# EasyEDA Pro project ProPrj_STM L_2026-07-04.epro, schematic Schematic1
Board Name: Board1; Create Date: 2025-10-13; Page Name: P1; Project Name: STM Evolution Board; Schematic Name: Schematic1; Update Date: 2025-10-17; Company: EasyEDA.com; Page Size: A4; Version: V1.0
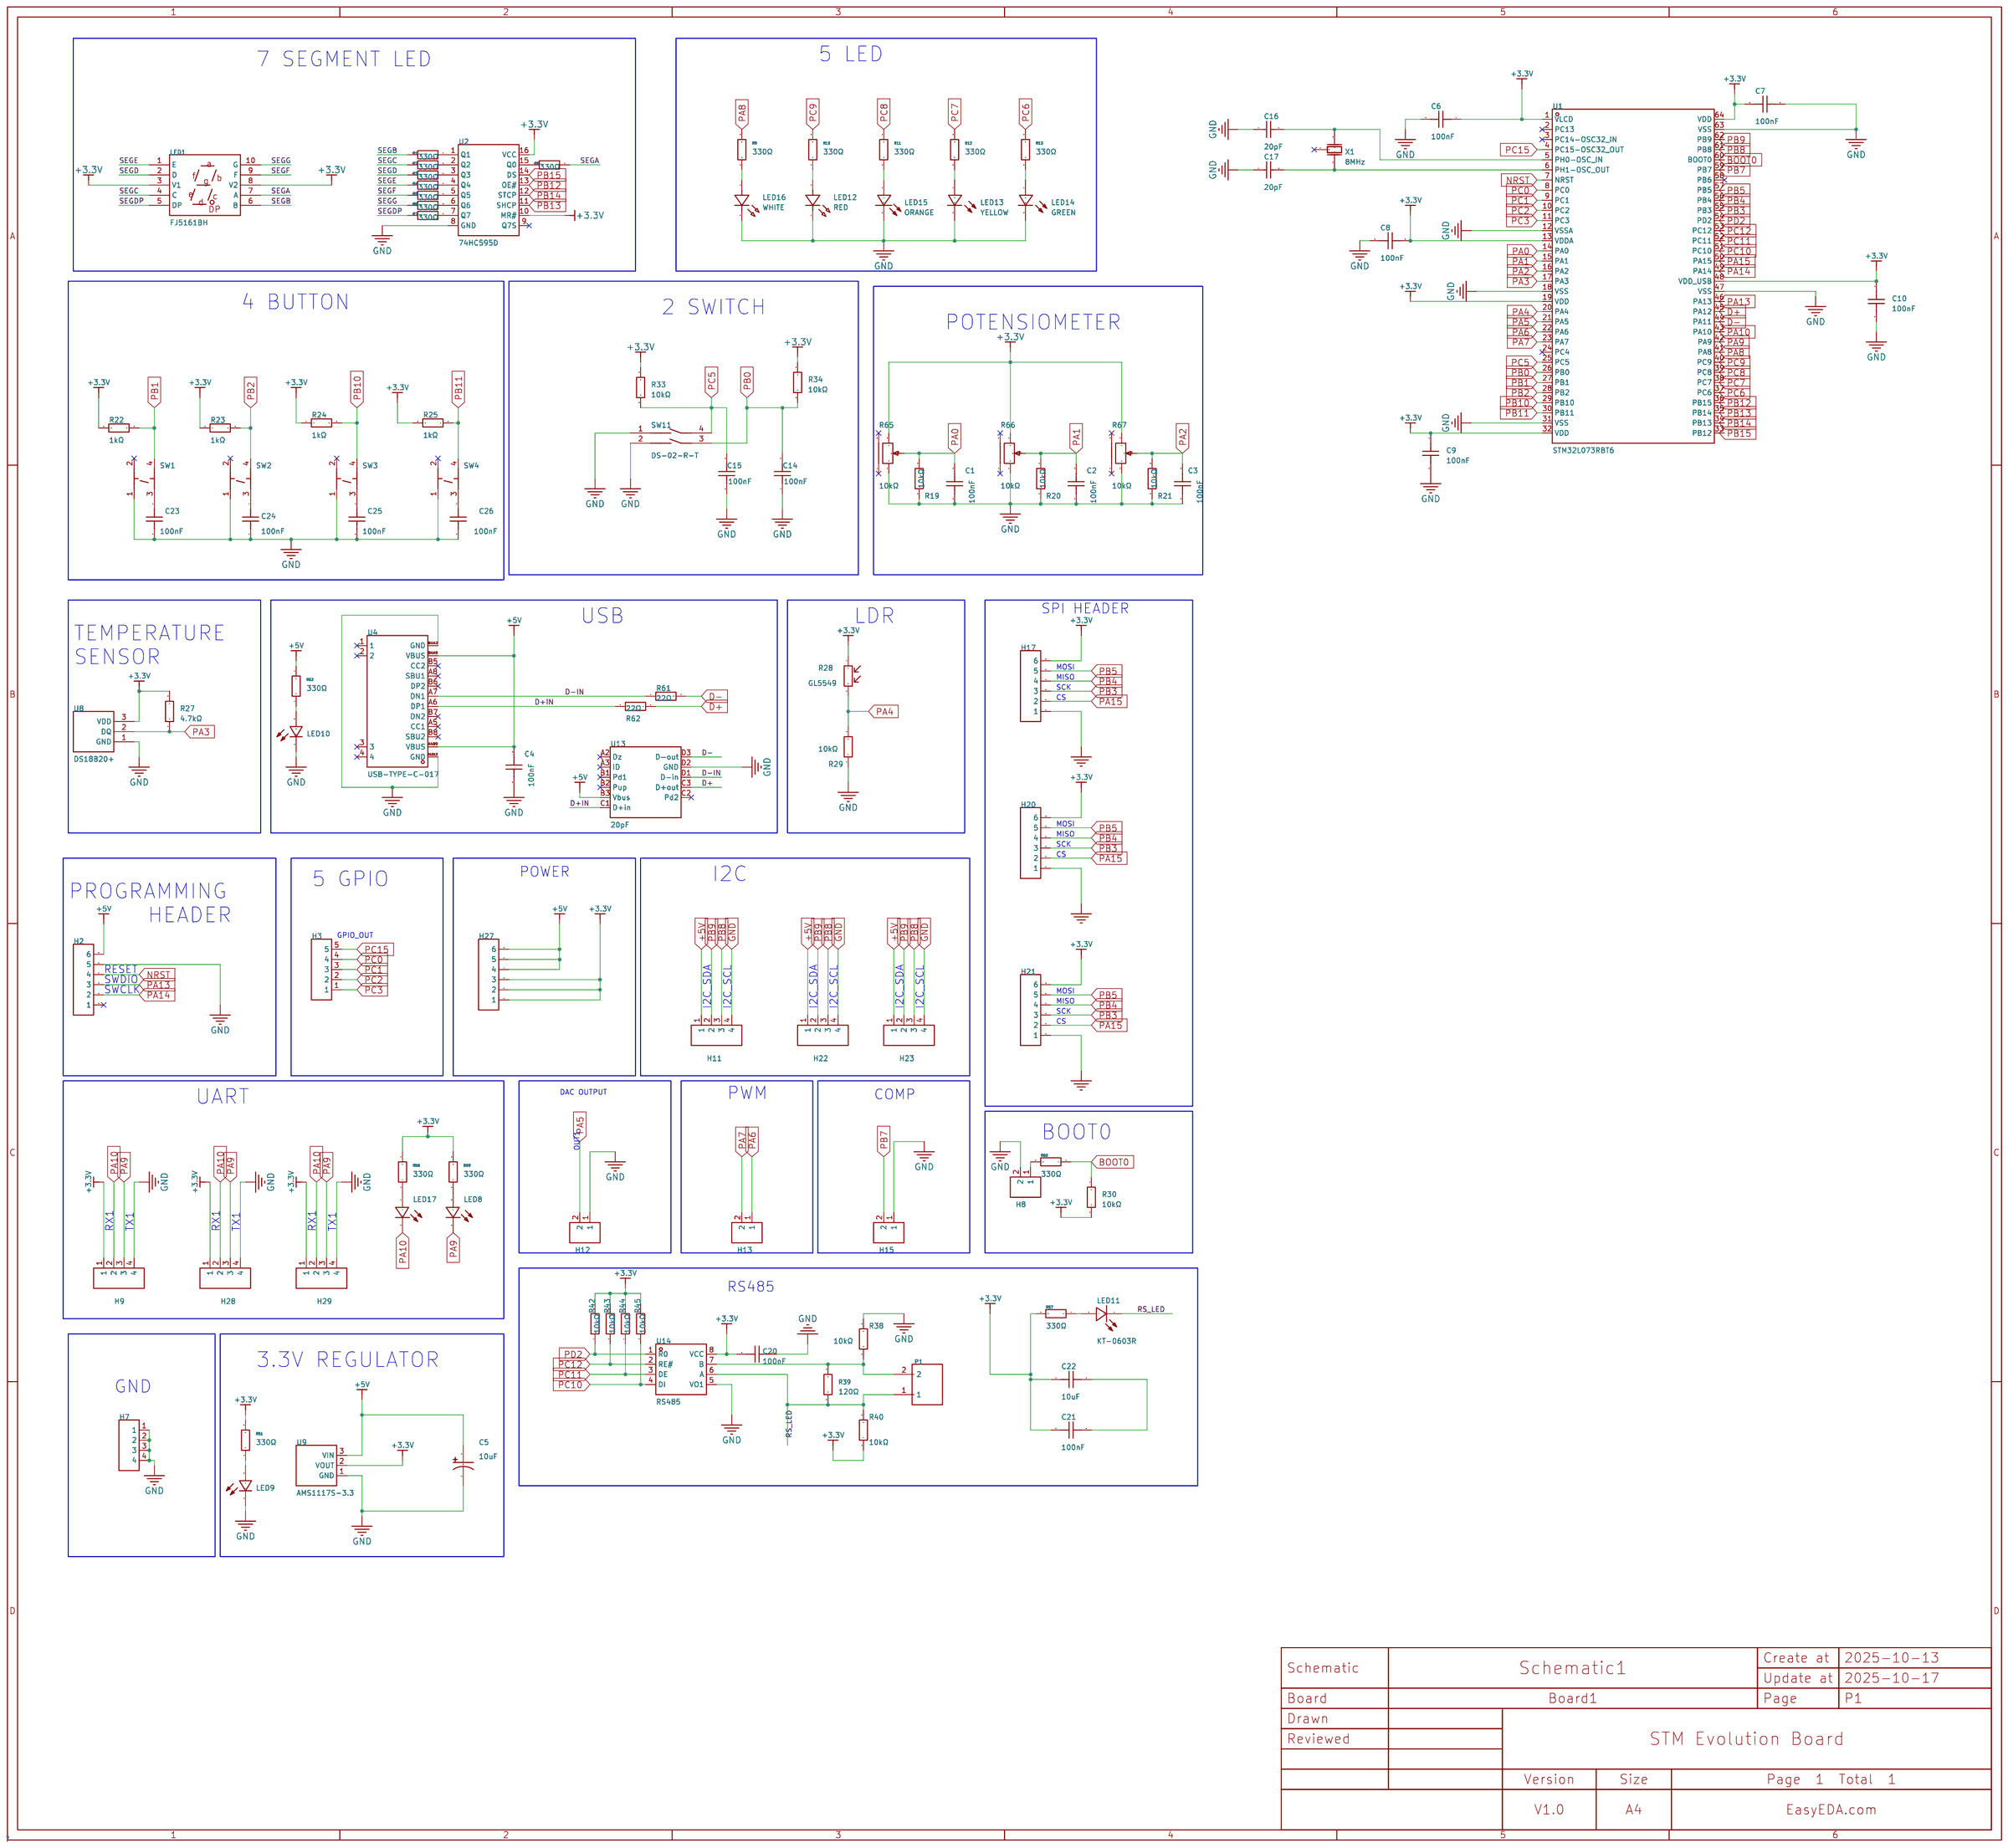
[diagram p0: schematic sheet]

## Parts
C1  100nF  [C0603]
C2  100nF  [C0603]
C3  100nF  [C0603]
C4  100nF  [C0603]
C5  10uF  [CAP-SMD_L3.2-W1.6]
C6  100nF  [C0603]
C7  100nF  [C0603]
C8  100nF  [C0603]
C9  100nF  [C0603]
C10  100nF  [C0603]
C14  100nF  [C0603]
C15  100nF  [C0603]
C16  20pF  [C0603]
C17  20pF  [C0603]
C20  100nF  [C0603]
C21  100nF  [C0603]
C22  10uF  [C0603]
C23  100nF  [C0603]
C24  100nF  [C0603]
C25  100nF  [C0603]
C26  100nF  [C0603]
H2  2.54-1x6P直针  [HDR-TH_6P-P2.54-V-M-1]
H3  PH2.54-1X5P-H25  [HDR-TH_5P-P2.54-V-M-3]
H7  PZ2.54-1X4P-H25  [HDR-TH_4P-P2.54-V-M]
H8  1.27-1*2P针  [HDR-TH_2P-P1.27-V-M]
H9  PZ2.54-1X4P-H25  [HDR-TH_4P-P2.54-V-M]
H11  PZ2.54-1X4P-H25  [HDR-TH_4P-P2.54-V-M]
H12  1.27-1*2P针  [HDR-TH_2P-P1.27-V-M]
H13  1.27-1*2P针  [HDR-TH_2P-P1.27-V-M]
H15  1.27-1*2P针  [HDR-TH_2P-P1.27-V-M]
H17  2.54-1x6P直针  [HDR-TH_6P-P2.54-V-M-1]
H20  2.54-1x6P直针  [HDR-TH_6P-P2.54-V-M-1]
H21  2.54-1x6P直针  [HDR-TH_6P-P2.54-V-M-1]
H22  PZ2.54-1X4P-H25  [HDR-TH_4P-P2.54-V-M]
H23  PZ2.54-1X4P-H25  [HDR-TH_4P-P2.54-V-M]
H27  2.54-1x6P直针  [HDR-TH_6P-P2.54-V-M-1]
H28  PZ2.54-1X4P-H25  [HDR-TH_4P-P2.54-V-M]
H29  PZ2.54-1X4P-H25  [HDR-TH_4P-P2.54-V-M]
LED1  FJ5161BH  [LED-SEG-TH_FJ5161BH]
LED8  YLED0603R  [LED0603-FD]
LED9  NCD0603G1  [LED0603-RD_1]
LED10  NCD0603G1  [LED0603-RD_1]
LED11  KT-0603R  [LED0603-RD]
LED12  RED  [LED-TH_BD3.8-P2.54-RD]
LED13  YELLOW  [LED-TH_BD4.0-P2.54-FD]
LED14  GREEN  [LED-TH_BD4.0-P2.54-FD]
LED15  ORANGE  [LED-TH_BD3.0-P2.54-FD]
LED16  WHITE  [LED-TH_BD3.8-P2.54-FD_WHITE]
LED17  YLED0603R  [LED0603-FD]
P1  WJ126V-5.0-2P  [CONN-TH_WJ126V-5.0-2P]
R1  330Ω  [R0603]
R2  330Ω  [R0603]
R3  330Ω  [R0603]
R4  330Ω  [R0603]
R5  330Ω  [R0603]
R6  330Ω  [R0603]
R7  330Ω  [R0603]
R8  330Ω  [R0603]
R9  330Ω  [R0603]
R10  330Ω  [R0603]
R11  330Ω  [R0603]
R12  330Ω  [R0603]
R13  330Ω  [R0603]
R19  10kΩ  [R0603]
R20  10kΩ  [R0603]
R21  10kΩ  [R0603]
R22  1kΩ  [R0603]
R23  1kΩ  [R0603]
R24  1kΩ  [R0603]
R25  1kΩ  [R0603]
R27  4.7kΩ  [R0603]
R28  GL5549  [RES-TH_L5.1-W4.3-P3.40-D0.5]
R29  10kΩ  [R0603]
R30  10kΩ  [R0603]
R33  10kΩ  [R0603]
R34  10kΩ  [R0603]
R38  10kΩ  [R0603]
R39  120Ω  [R0603]
R40  10kΩ  [R0603]
R42  10kΩ  [R0603]
R43  10kΩ  [R0603]
R44  10kΩ  [R0603]
R45  10kΩ  [R0603]
R51  330Ω  [R0603]
R52  330Ω  [R0603]
R57  330Ω  [R0603]
R58  330Ω  [R0603]
R59  330Ω  [R0603]
R60  330Ω  [R0603]
R61  22Ω  [R0603]
R62  22Ω  [R0603]
R65  10kΩ  [RES-ADJ-TH_RK09K1130AJ3]
R66  10kΩ  [RES-ADJ-TH_RK09K1130AJ3]
R67  10kΩ  [RES-ADJ-TH_RK09K1130AJ3]
SW1  LXW-TS-6X6X5-SMD  [SW-SMD_4P-L6.0-W6.0-P4.50-LS7.2]
SW2  LXW-TS-6X6X5-SMD  [SW-SMD_4P-L6.0-W6.0-P4.50-LS7.2]
SW3  LXW-TS-6X6X5-SMD  [SW-SMD_4P-L6.0-W6.0-P4.50-LS7.2]
SW4  LXW-TS-6X6X5-SMD  [SW-SMD_4P-L6.0-W6.0-P4.50-LS7.2]
SW11  DS-02-R-T  [SW-TH_4P-P2.54_DS-02R]
U1  STM32L073RBT6  [LQFP-64_L10.0-W10.0-P0.50-LS12.0-BL]
U2  74HC595D  [SOIC-16_L9.9-W3.9-P1.27-LS6.0-BL]
U4  USB-TYPE-C-017  [USB-TYPE-C-SMD_C9900008089]
U8  DS18B20+  [TO-92-3_L4.9-W3.7-P1.27-L]
U9  AMS1117S-3.3  [SOT-89-3_L4.5-W2.5-P1.50-LS4.1-BR]
U13  20pF  [BGA-11_L2.0-W1.4-P0.50-TL]
U14  RS485  [SOP-8_L4.9-W3.9-P1.27-LS6.0-BL]
X1  8MHz  [OSC-SMD_3P-L3.2-W1.3-P1.20-L]

## Library data of the parts
C1-C4 C6-C10 C14 C15 C20 C21 C23-C26 = CC0603KRX7R9BB104: Capacitance:100nF Tolerance:±10% Tolerance:±10% Voltage Rating:50V Temperature Coefficient:X7R; LCSC Part Name: 100nF ±10% 50V; Supplier Part: C14663; Manufacturer: YAGEO(国巨); Supplier Footprint: 0603; JLCPCB Part Class: Basic Part; Datasheet: https://item.szlcsc.com/datasheet/CC0603KRX7R9BB104/15331.html; Supplier: LCSC; Tolerance: ±10%; Voltage Rating: 50V; Temperature Coefficient: X7R
C5 = NOJA106M010RWJ: Capacitance: Tolerance:±20% Tolerance:±20% Rated Voltage: Equivalent Series   Resistance(ESR):2.2Ω@100kHz Leakage Current(DCL): Dissipation Factor:6% Operating Temperature:-55℃~+105℃ Operating Temperature:-55℃~+105℃; LCSC Part Name: 10uF ±20% 10V; Supplier Part: C444733; Manufacturer: Kyocera AVX; Supplier Footprint: CASE-A-3216-18(mm); JLCPCB Part Class: Extended Part; Datasheet: https://atta.szlcsc.com/upload/public/pdf/source/20191107/C444734_54A3C6EA0F0DA246BA7C015D9FD916EF.pdf; Supplier: LCSC; Tolerance: ±20%; Equivalent Series   Resistance(ESR): 2.2Ω@100kHz; Dissipation Factor: 6%; Operating Temperature: -55℃~+105℃
C16 C17 = CL10C200JB8NNNC: Capacitance:20pF Tolerance:±5% Tolerance:±5% Voltage Rating:50V Temperature Coefficient:C0G; LCSC Part Name: 20pF ±5% 50V; Supplier Part: C1648; Manufacturer: SAMSUNG(三星); Supplier Footprint: 0603; JLCPCB Part Class: Basic Part; Datasheet: https://item.szlcsc.com/datasheet/CL10C200JB8NNNC/2000.html; Supplier: LCSC; Tolerance: ±5%; Voltage Rating: 50V; Temperature Coefficient: C0G
C22 = CL10A106KP8NNNC: Capacitance:10uF Tolerance:±10% Tolerance:±10% Voltage Rating:10V Temperature Coefficient:X5R; LCSC Part Name: 10uF ±10% 10V; Supplier Part: C19702; Manufacturer: SAMSUNG(三星); Supplier Footprint: 0603; JLCPCB Part Class: Basic Part; Datasheet: https://item.szlcsc.com/datasheet/CL10A106KP8NNNC/20411.html; Supplier: LCSC; Tolerance: ±10%; Voltage Rating: 10V; Temperature Coefficient: X5R
H2 H17 H20 H21 H27 = 2.54-1x6P直针: Pin Structure:1x6P Pitch:2.54mm Row Spacing:- Circluar Pins/Square Pins:Pin Header Mounting Type:Through Hole Number of Rows:1 Number of Pins:6P Current Rating:3A Voltage Rating (Max):- Length of Mating Pin:6mm Insulation Height:2.5mm Length of End Connec; LCSC Part Name: 1x6P 间距:2.54mm 方针 直插; Supplier Part: C37208; Manufacturer: BOOMELE(博穆精密); Supplier Footprint: 插件,P=2.54mm; JLCPCB Part Class: Extended Part; Datasheet: https://item.szlcsc.com/datasheet/2.54-1x6P%25E7%259B%25B4%25E9%2592%2588/38187.html; Supplier: LCSC; Pin Structure: 1x6P; Pitch: 2.54mm; Circluar Pins/Square Pins: Pin Header; Mounting Type: Through Hole; Number of Rows: 1; Number of Pins: 6P; Current Rating: 3A; Length of Mating Pin: 6mm; Insulation Height: 2.5mm; Length of End Connection Pin: 3mm; Contact Material: Brass; Contact Plating: Gold; Operating Temperature: -40℃~+105℃; Color: Black
H3 = PH2.54-1X5P-H25: Pin Structure:1x5P Pitch:2.54mm Row Spacing:- Circluar Pins/Square Pins:Pin Header Mounting Type:Through Hole Number of Rows:1 Number of Pins:5P Current Rating:3A Voltage Rating (Max):- Length of Mating Pin:6mm Insulation Height:2.5mm Length of End Connec; LCSC Part Name: 1x5P 间距:2.54mm 方针 直插; Supplier Part: C42431835; Manufacturer: JXTCONN(聚兴泰); Supplier Footprint: 插件,P=2.54mm; JLCPCB Part Class: Extended Part; Datasheet: https://item.szlcsc.com/datasheet/PH2.54-1X5P-H25/44458965.html; Supplier: LCSC; Pin Structure: 1x5P; Pitch: 2.54mm; Circluar Pins/Square Pins: Pin Header; Mounting Type: Through Hole; Number of Rows: 1; Number of Pins: 5P; Current Rating: 3A; Length of Mating Pin: 6mm; Insulation Height: 2.5mm; Length of End Connection Pin: 3mm; Contact Material: Brass; Contact Plating: Gold; Operating Temperature: -40℃~+105℃; Color: Black
H7 H9 H11 H22 H23 H28 H29 = PZ2.54-1X4P-H25: Pin Structure:1x4P Pitch:2.54mm Row Spacing:- Circluar Pins/Square Pins:Pin Header Mounting Type:Through Hole Number of Rows:1 Number of Pins:4P Current Rating:3A Voltage Rating (Max):- Length of Mating Pin:6mm Insulation Height:2.5mm Length of End Connec; LCSC Part Name: 1x4P 间距:2.54mm 方针 直插; Supplier Part: C42431787; Manufacturer: JXTCONN(聚兴泰); Supplier Footprint: 插件,P=2.54mm; JLCPCB Part Class: Extended Part; Datasheet: https://item.szlcsc.com/datasheet/PZ2.54-1X4P-H25/44458917.html; Supplier: LCSC; Pin Structure: 1x4P; Pitch: 2.54mm; Circluar Pins/Square Pins: Pin Header; Mounting Type: Through Hole; Number of Rows: 1; Number of Pins: 4P; Current Rating: 3A; Length of Mating Pin: 6mm; Insulation Height: 2.5mm; Length of End Connection Pin: 3mm; Contact Material: Brass; Contact Plating: Gold; Operating Temperature: -40℃~+105℃; Color: Black
H8 H12 H13 H15 = 1.27-1*2P针: Pin Structure:1x2P Pitch:1.27mm Row Spacing:- Circluar Pins/Square Pins:Pin Header Mounting Type:Through Hole Number of Rows:1 Number of Pins:2P Current Rating:3A Voltage Rating (Max):- Length of Mating Pin:3mm Insulation Height:1.7mm Length of End Connec; LCSC Part Name: 1x2P 间距:1.27mm 方针 直插; Supplier Part: C703015; Manufacturer: BOOMELE(博穆精密); Supplier Footprint: 插件,P=1.27mm; JLCPCB Part Class: Extended Part; Datasheet: https://item.szlcsc.com/datasheet/1.27-1*2P%25E9%2592%2588/738187.html; Supplier: LCSC; Pin Structure: 1x2P; Pitch: 1.27mm; Circluar Pins/Square Pins: Pin Header; Mounting Type: Through Hole; Number of Rows: 1; Number of Pins: 2P; Current Rating: 3A; Length of Mating Pin: 3mm; Insulation Height: 1.7mm; Length of End Connection Pin: 2.5mm; Contact Material: Brass; Operating Temperature: -55℃~+105℃; Color: Black
LED1 = FJ5161BH: Number of Characters:1 Display Type:7 Segment Digit/Alpha Size(inch):0.56 Pd - Power Dissipation:- Illumination Color:Red LED Polarity:Common Anode; LCSC Part Name: 1位0.56英寸红色数码管 共阳极; Supplier Part: C8092; Manufacturer: 志浩; Supplier Footprint: 插件; JLCPCB Part Class: Extended Part; Datasheet: https://item.szlcsc.com/datasheet/FJ5161BH/8574.html; Supplier: LCSC; Number of Characters: 1; Display Type: 7 Segment; Digit/Alpha Size(inch): 0.56; Illumination Color: Red; LED Polarity: Common Anode
LED8 LED17 = YLED0603R: Emitted Color:Red Forward Voltage (VF):1.8V~2.4V Forward Voltage (VF):1.8V~2.4V Power Dissipation:- Forward Current:25mA Dominant Wavelength:620nm~625nm Dominant Wavelength:620nm~625nm Peak Wavelength:- Diode Configuration:- Lens Color:- Color Temperature; Supplier Part: C19171390; Manufacturer: YONGYUTAI(永裕泰); Supplier Footprint: 0603; JLCPCB Part Class: Extended Part; Datasheet: https://atta.szlcsc.com/upload/public/pdf/source/20231027/FB19AF06E2C70028E58AB5CEDD1BDC72.pdf; Supplier: LCSC; Emitted Color: Red; Forward Voltage (VF): 1.8V~2.4V; Forward Current: 25mA; Dominant Wavelength: 620nm~625nm; Operating Temperature: -40℃~+85℃
LED9 LED10 = NCD0603G1: Illumination Color:Emerald Voltage - Forward(Vf):2.6V~3.6V Voltage - Forward(Vf):2.6V~3.6V Power(Watts):72mW Forward Current:20mA Wavelength - Dominant:515nm~530nm Wavelength - Dominant:515nm~530nm Lens Color:- Luminous Intensity:330mcd~900mcd Luminous In; Supplier Part: C84267; Manufacturer: 国星光电; Supplier Footprint: 0603; JLCPCB Part Class: Extended Part; Datasheet: https://item.szlcsc.com/datasheet/NCD0603G1/85436.html; Supplier: LCSC; Illumination Color: Emerald; Voltage - Forward(Vf): 2.6V~3.6V; Power(Watts): 72mW; Forward Current: 20mA; Wavelength - Dominant: 515nm~530nm; Luminous Intensity: 330mcd~900mcd; Viewing Angle: 130°; Operating Temperature: -30℃~+85℃
LED11 = KT-0603R: Emitted Color:Red Power Dissipation:- Forward Current:- Dominant Wavelength:- Dominant Wavelength:- Peak Wavelength:- Diode Configuration:- Lens Color:- Color Temperature:- Color Temperature:- Viewing Angle:- Mounting Sytle:- Operating Temperature:-40℃~+8; LCSC Part Name: 0603 红灯 高亮; Supplier Part: C2286; Manufacturer: KENTO; Supplier Footprint: 0603; JLCPCB Part Class: Basic Part; Datasheet: https://atta.szlcsc.com/upload/public/pdf/source/20160616/1466072038404.pdf; Supplier: LCSC; Emitted Color: Red; Operating Temperature: -40℃~+85℃
LED12 = XL-302SURD: Lamp Holder Type:3mm Round Lens Illumination Color:Red Voltage - Forward(Vf):2.2V Voltage - Forward(Vf):2.2V Power(Watts):50mW Forward Current:20mA Wavelength - Dominant:620nm~630nm Wavelength - Dominant:620nm~630nm Peak Wavelength:625nm Diode Configurati; Supplier Part: C2895470; Manufacturer: XINGLIGHT(成兴光); Supplier Footprint: 插件,D=3mm; JLCPCB Part Class: Extended Part; Datasheet: https://item.szlcsc.com/datasheet/XL-302SURD/3136185.html; Supplier: LCSC; Lamp Holder Type: 3mm Round Lens; Illumination Color: Red; Voltage - Forward(Vf): 2.2V; Power(Watts): 50mW; Forward Current: 20mA; Wavelength - Dominant: 620nm~630nm; Peak Wavelength: 625nm; Lens Color: Red Lens; Luminous Intensity: 1000mcd; Viewing Angle: 35°; Operating Temperature: -20℃~+85℃
LED13 LED14 = 204-10UYT/S530-A3: Lamp Holder Type:3mm圆形灯头 Emitted Color:Yellow Forward Voltage (VF):2V Forward Voltage (VF):2V Forward Current:20mA Dominant Wavelength:589nm Dominant Wavelength:589nm Peak Wavelength:591nm Lens Color:黄色透镜 Luminous Intensity:500mcd Luminous Intensity:500mc; LCSC Part Name: 黄灯; Supplier Part: C282137; Manufacturer: EVERLIGHT(亿光); Supplier Footprint: 插件,D=3mm; JLCPCB Part Class: Extended Part; Datasheet: https://atta.szlcsc.com/upload/public/pdf/source/20181026/C282137_6D218B8CC23FC5624A0E16147EFD8814.pdf; Supplier: LCSC; Lamp Holder Type: 3mm圆形灯头; Emitted Color: Yellow; Forward Voltage (VF): 2V; Forward Current: 20mA; Dominant Wavelength: 589nm; Peak Wavelength: 591nm; Lens Color: 黄色透镜; Luminous Intensity: 500mcd; Viewing Angle: 20°
LED15 = TJ-L3FYTXHAMCGLFLC0A-A5: Lamp Holder Type:3mm Round Lens Illumination Color:Orange Voltage - Forward(Vf):2.6V Voltage - Forward(Vf):2.6V Power(Watts):72mW Forward Current:20mA Wavelength - Dominant:600nm~610nm Wavelength - Dominant:600nm~610nm Peak Wavelength:610nm Lens Color:Dif; LCSC Part Name: 橙灯; Supplier Part: C330758; Manufacturer: TOGIALED(统佳); Supplier Footprint: 插件,D=3mm; JLCPCB Part Class: Extended Part; Datasheet: https://item.szlcsc.com/datasheet/TJ-L3FYTXHAMCGLFLC0A-A5/310371.html; Supplier: LCSC; Lamp Holder Type: 3mm Round Lens; Illumination Color: Orange; Voltage - Forward(Vf): 2.6V; Power(Watts): 72mW; Forward Current: 20mA; Wavelength - Dominant: 600nm~610nm; Peak Wavelength: 610nm; Lens Color: Diffused Orange Lens; Luminous Intensity: 500mcd; Viewing Angle: 45°; Operating Temperature: -20℃~+80℃
LED16 = XL-302UWC: Lamp Holder Type:3mm Round Lens Illumination Color:White Voltage - Forward(Vf):3.2V Voltage - Forward(Vf):3.2V Power(Watts):70mW Forward Current:20mA Lens Color:Water Clear Color Temperature:6000K~8000K Color Temperature:6000K~8000K Luminous Intensity:800; LCSC Part Name: 白发白短脚发光器件; Supplier Part: C2895458; Manufacturer: XINGLIGHT(成兴光); Supplier Footprint: 插件,D=3mm; JLCPCB Part Class: Extended Part; Datasheet: https://atta.szlcsc.com/upload/public/pdf/source/20250716/2CD7D6C127B884119A4550035EC69AE5.pdf; Supplier: LCSC; Lamp Holder Type: 3mm Round Lens; Illumination Color: White; Voltage - Forward(Vf): 3.2V; Power(Watts): 70mW; Forward Current: 20mA; Lens Color: Water Clear; Color Temperature: 6000K~8000K; Luminous Intensity: 8000mcd; Viewing Angle: 30°; Operating Temperature: -20℃~+85℃
P1 = WJ126V-5.0-2P: Structure:1x2P Pitch:5mm Color:Green Mounting Style:Straight Current Rating (Max):18A Voltage Rating (Max):250V Number of Pins:2P Number of Rows:1 Wire Gauge - AWG:14~26 Wire Gauge - AWG:14~26 Wire Gauge - mm2:2.5 Wire Gauge - mm2:2.5 Number of PINs Per R; LCSC Part Name: 5mm 1x2P 排数:1 每排P数:2 直插; Supplier Part: C8404; Manufacturer: KANGNEX(康奈克斯电气); Supplier Footprint: 插件,P=5mm; JLCPCB Part Class: Extended Part; Datasheet: https://atta.szlcsc.com/upload/public/pdf/source/20191225/C8404_8F52D87DF851D149A4DEA9BD9FA83F9A.pdf; Supplier: LCSC; Structure: 1x2P; Pitch: 5mm; Color: Green; Mounting Style: Straight; Current Rating (Max): 18A; Voltage Rating (Max): 250V; Number of Pins: 2P; Number of Rows: 1; Wire Gauge - AWG: 14~26; Wire Gauge - mm2: 2.5; Number of PINs Per Row: 2; Operating Temperature Range: -40℃~+105℃
R1-R13 R51 R52 R57-R60 = RC0603FR-07330RL: Type:Thick Film Resistors Resistance: Tolerance:±1% Tolerance:±1% Power(Watts): Overload Voltage (Max): Temperature Coefficient:±100ppm/℃ Temperature Coefficient:±100ppm/℃ Operating Temperature Range:-55℃~+155℃ Operating Temperature Range:-55℃~+155℃; LCSC Part Name: 厚膜电阻 330Ω ±1% 100mW; Supplier Part: C105881; Manufacturer: YAGEO(国巨); Supplier Footprint: 0603; JLCPCB Part Class: Extended Part; Datasheet: https://atta.szlcsc.com/upload/public/pdf/source/20180821/C275644_0D56F95EFF785E7D9A1FEF436B37DA78.pdf; Supplier: LCSC; Type: Thick Film Resistors; Tolerance: ±1%; Temperature Coefficient: ±100ppm/℃; Operating Temperature Range: -55℃~+155℃
R19-R21 R29 R30 R33 R34 R38 R40 R42-R45 = RC0603FR-0710KL: Type:Thick Film Resistors Resistance: Tolerance:±1% Tolerance:±1% Power(Watts): Overload Voltage (Max): Temperature Coefficient:±100ppm/℃ Temperature Coefficient:±100ppm/℃ Operating Temperature Range:-55℃~+155℃ Operating Temperature Range:-55℃~+155℃; LCSC Part Name: 厚膜电阻 10kΩ ±1% 100mW; Supplier Part: C98220; Manufacturer: YAGEO(国巨); Supplier Footprint: 0603; JLCPCB Part Class: Extended Part; Datasheet: https://atta.szlcsc.com/upload/public/pdf/source/20180927/C295883_E8D83085EA81BD7DE0B2B681138C15EE.pdf; Supplier: LCSC; Type: Thick Film Resistors; Tolerance: ±1%; Temperature Coefficient: ±100ppm/℃; Operating Temperature Range: -55℃~+155℃
R22-R25 = RC0603FR-071KL: Type:Thick Film Resistors Resistance:1kΩ Tolerance:±1% Tolerance:±1% Power(Watts):100mW Voltage-Supply(Max):75V Temperature Coefficient:±100ppm/℃ Temperature Coefficient:±100ppm/℃ Operating Temperature:-55℃~+155℃ Operating Temperature:-55℃~+155℃; LCSC Part Name: 厚膜电阻 1kΩ ±1% 100mW; Supplier Part: C22548; Manufacturer: YAGEO(国巨); Supplier Footprint: 0603; JLCPCB Part Class: Extended Part; Datasheet: https://atta.szlcsc.com/upload/public/pdf/source/20180316/70C0E2BDAE7FCC62C531A5A58D202EE1.pdf; Supplier: LCSC; Type: Thick Film Resistors; Tolerance: ±1%; Power(Watts): 100mW; Voltage-Supply(Max): 75V; Temperature Coefficient: ±100ppm/℃; Operating Temperature: -55℃~+155℃
R27 = RC0603FR-074K7L: Type:Thick Film Resistor Resistance:4.7kΩ Tolerance:±1% Tolerance:±1% Power(Watts):100mW Voltage-Supply(Max):75V Temperature Coefficient:±100ppm/℃ Temperature Coefficient:±100ppm/℃ Operating Temperature:-55℃~+155℃ Operating Temperature:-55℃~+155℃; LCSC Part Name: 厚膜电阻 4.7kΩ ±1% 100mW; Supplier Part: C99782; Manufacturer: YAGEO(国巨); Supplier Footprint: 0603; JLCPCB Part Class: Extended Part; Datasheet: https://atta.szlcsc.com/upload/public/pdf/source/20250610/89E4D743C004A82A45145C7A2CC3A578.pdf; Supplier: LCSC; Type: Thick Film Resistor; Tolerance: ±1%; Power(Watts): 100mW; Voltage-Supply(Max): 75V; Temperature Coefficient: ±100ppm/℃; Operating Temperature: -55℃~+155℃
R28 = GL5549: Dark Resistance:10MΩ Cell Resistance @ Illuminance:100kΩ~200kΩ Cell Resistance @ Illuminance:100kΩ~200kΩ Voltage - Max:150V Wavelength - Peak:540nm Rise Time:20ms Fall Time:30ms Operating Temperature:-30℃~+70℃ Operating Temperature:-30℃~+70℃ γ Value:0.9; Supplier Part: C125631; Manufacturer: 森霸; Supplier Footprint: 插件,P=3mm; JLCPCB Part Class: Extended Part; Datasheet: https://item.szlcsc.com/datasheet/GL5549/136909.html; Supplier: LCSC; Dark Resistance: 10MΩ; Cell Resistance @ Illuminance: 100kΩ~200kΩ; Voltage - Max: 150V; Wavelength - Peak: 540nm; Rise Time: 20ms; Fall Time: 30ms; Operating Temperature: -30℃~+70℃; γ Value: 0.9
R39 = 0603WAF1200T5E: Type:Thick Film Resistors Resistance: Tolerance:±1% Tolerance:±1% Power(Watts): Overload Voltage (Max): Temperature Coefficient:±100ppm/℃ Temperature Coefficient:±100ppm/℃ Operating Temperature Range:-55℃~+155℃ Operating Temperature Range:-55℃~+155℃; LCSC Part Name: 120Ω ±1% 100mW 厚膜电阻; Supplier Part: C22787; Manufacturer: UNI-ROYAL(厚声); Supplier Footprint: 0603; JLCPCB Part Class: Basic Part; Datasheet: https://atta.szlcsc.com/upload/public/pdf/source/20200306/C422600_1E6D84923E4A46A82E41ADD87F860B5C.pdf; Supplier: LCSC; Type: Thick Film Resistors; Tolerance: ±1%; Temperature Coefficient: ±100ppm/℃; Operating Temperature Range: -55℃~+155℃
R61 R62 = 0603WAF220JT5E: Type:Thick Film Resistors Resistance:22Ω Tolerance:±1% Tolerance:±1% Power(Watts): Overload Voltage (Max): Temperature Coefficient:±100ppm/℃ Temperature Coefficient:±100ppm/℃ Operating Temperature Range:-55℃~+155℃ Operating Temperature Range:-55℃~+155℃; LCSC Part Name: 22Ω ±1% 100mW 厚膜电阻; Supplier Part: C23345; Manufacturer: UNI-ROYAL(厚声); Supplier Footprint: 0603; JLCPCB Part Class: Basic Part; Datasheet: https://atta.szlcsc.com/upload/public/pdf/source/20200306/C422600_1E6D84923E4A46A82E41ADD87F860B5C.pdf; Supplier: LCSC; Type: Thick Film Resistors; Tolerance: ±1%; Temperature Coefficient: ±100ppm/℃; Operating Temperature Range: -55℃~+155℃
R65-R67 = RK09K1130AP5: Resistance:10kΩ Tolerance:±20% Tolerance:±20% Voltage Rating:20V Power(Watts):50mW Number of Turns:-; LCSC Part Name: 10kΩ ±20%; Supplier Part: C470295; Manufacturer: ALPSALPINE(阿尔卑斯阿尔派); Supplier Footprint: 插件; JLCPCB Part Class: Extended Part; Datasheet: https://atta.szlcsc.com/upload/public/pdf/source/20191216/C470452_A95F493F84F2A4E5D2456A617FF6269D.pdf; Supplier: LCSC; Tolerance: ±20%; Voltage Rating: 20V; Power(Watts): 50mW
SW1-SW4 = LXW-TS-6X6X5-SMD: Circuit:SPST-NO Actuator Style:Round Button Operating Force:2.5N Mounting Type:Surface Mount,Vertical Length:6mm Width:6mm Switch Height:5mm with Bracket:Without Bracket Contact Current:50mA Voltage Rating:12V Actuator/Cap Color:Black Termination Style:SM; LCSC Part Name: 6*6*5mm 立贴 轻触开关; Supplier Part: C53447020; Manufacturer: LXWCONN(连兴旺电子); Supplier Footprint: SMD-4P,6x6mm; JLCPCB Part Class: Extended Part; Datasheet: https://item.szlcsc.com/datasheet/LXW-TS-6X6X5-SMD/56599279.html; Supplier: LCSC; Circuit: SPST-NO; Actuator Style: Round Button; Operating Force: 2.5N; Mounting Type: Surface Mount,Vertical; Length: 6mm; Width: 6mm; Switch Height: 5mm; with Bracket: Without Bracket; Contact Current: 50mA; Voltage Rating: 12V; Actuator/Cap Color: Black; Termination Style: SMD(SMT) Tab; Life: 100,000 cycles
SW11 = DS-02-R-T: Circuit:SPST Number of Positions:2Bit Lead Pitch:2.54mm Current Rating:25mA Voltage Rating:24V Operating Temperature:-30℃~+85℃ Operating Temperature:-30℃~+85℃ Operating Life:3000 Times Color:Red; LCSC Part Name: 2位 2.54mm间距 宽体 拨码开关; Supplier Part: C5123700; Manufacturer: 康深; Supplier Footprint: 插件; JLCPCB Part Class: Extended Part; Datasheet: https://item.szlcsc.com/datasheet/DS-02-R-T/5718046.html; Supplier: LCSC; Circuit: SPST; Number of Positions: 2Bit; Lead Pitch: 2.54mm; Current Rating: 25mA; Voltage Rating: 24V; Operating Temperature: -30℃~+85℃; Operating Life: 3000 Times; Color: Red
U1 = STM32L073RBT6_C2917159: CPU Core:ARM Cortex-M Series CPU Maximum Speed:32MHz Program Storage Size:128KB Program Memory Type:FLASH EEPROM:6KB Applications:-; LCSC Part Name: 超低功耗Arm Cortex-M0+ MCU，具有128-KB Flash、32 MHz CPU、USB和LCD; Supplier Part: C2917159; Manufacturer: ST(意法半导体); Supplier Footprint: LQFP-64(10x10); JLCPCB Part Class: Extended Part; Datasheet: https://item.szlcsc.com/datasheet/STM32L073RBT6/3215778.html; Supplier: LCSC; CPU Core: ARM Cortex-M Series; CPU Maximum Speed: 32MHz; Program Storage Size: 128KB; Program Memory Type: FLASH; EEPROM: 6KB
U2 = 74HC595D,118: Function:Serial-to-Serial or Parallel Voltage - Supply:2V~6V Voltage - Supply:2V~6V Number of Elements:1 Number of Bits per Element:8 Output Type:Tri-State Series:74HC Operating Temperature:-40℃~+125℃ Operating Temperature:-40℃~+125℃; LCSC Part Name: 三态输出 串行至串行或并行移位寄存器; Supplier Part: C5947; Manufacturer: Nexperia(安世); Supplier Footprint: SOIC-16; JLCPCB Part Class: Basic Part; Datasheet: https://item.szlcsc.com/datasheet/74HC595D%252C118/6413.html; Supplier: LCSC; Function: Serial-to-Serial or Parallel; Voltage - Supply: 2V~6V; Number of Elements: 1; Number of Bits per Element: 8; Output Type: Tri-State; Series: 74HC; Operating Temperature: -40℃~+125℃
U4 = USB-TYPE-C-017: Connector Type:Type-C Standard:- Gender:Female Number of Ports:1 Number of Contacts:16P Mounting Style:卧贴 Current Rating - Power (Max):3A Operating Temperature Range:-25℃~+85℃ Operating Temperature Range:-25℃~+85℃; LCSC Part Name: Type-C 母 卧贴; Supplier Part: C2927037; Manufacturer: DEALON(德艺隆); Supplier Footprint: SMD; JLCPCB Part Class: Extended Part; Datasheet: https://atta.szlcsc.com/upload/public/pdf/source/20211217/653222EE5174722C9DFE2966329956D8.pdf; Supplier: LCSC; Connector Type: Type-C; Gender: Female; Number of Ports: 1; Number of Contacts: 16P; Mounting Style: 卧贴; Current Rating - Power (Max): 3A; Operating Temperature Range: -25℃~+85℃
U8 = DS18B20+: Voltage - Supply:3V~5.5V Voltage - Supply:3V~5.5V; LCSC Part Name: DS18B20; Supplier Part: C9753; Manufacturer: ADI(亚德诺)/MAXIM(美信); Supplier Footprint: TO-92; JLCPCB Part Class: Extended Part; Datasheet: https://item.szlcsc.com/datasheet/DS18B20%252B/10283.html; Supplier: LCSC; Voltage - Supply: 3V~5.5V
U9 = AMS1117S-3.3: Output Type:Fixed Voltage - Supply:30V Output Voltage:3.3V Output Voltage:3.3V Output Current:1A Power Supply Rejection Ratio (PSRR):70dB@(120Hz) standby current:3mA Noise:- Operating Temperature:-40℃~+125℃@(Tj) Operating Temperature:-40℃~+125℃@(Tj) Outpu; Supplier Part: C917152; Manufacturer: JSMSEMI(杰盛微); Supplier Footprint: SOT-89-3; JLCPCB Part Class: Extended Part; Datasheet: https://item.szlcsc.com/datasheet/AMS1117S-3.3/991648.html; Supplier: LCSC; Output Type: Fixed; Voltage - Supply: 30V; Output Voltage: 3.3V; Output Current: 1A; Power Supply Rejection Ratio (PSRR): 70dB@(120Hz); standby current: 3mA; Operating Temperature: -40℃~+125℃@(Tj); Output Configuration: Positive; Number of Outputs: 1
U13 = EMIF02-USB03F2: Filter Order:2 Capacitance:20pF ESD Protection:Yes Number of Channels:2 Operating Temperature:-40℃~+85℃ Operating Temperature:-40℃~+85℃; LCSC Part Name: EMIF02-USB03F2 停产; Supplier Part: C2969766; Manufacturer: ST(意法半导体); Supplier Footprint: WFBGA-11; JLCPCB Part Class: Extended Part; Datasheet: https://atta.szlcsc.com/upload/public/pdf/source/20220616/DFC4C0C8BDAA1FD0939E1997BD1EE6A7.pdf; Supplier: LCSC; Filter Order: 2; ESD Protection: Yes; Number of Channels: 2; Operating Temperature: -40℃~+85℃
U14 = RS485: Supplier Part: C19631832; Manufacturer: GR(国睿); Supplier Footprint: SOP-8; JLCPCB Part Class: Extended Part; Datasheet: https://item.szlcsc.com/datasheet/RS485/20927382.html; Supplier: LCSC
X1 = CSTNE8M00GH5C000R0: Frequency:8MHz Built - in Load Capacitance:33pF Resonant Impedance:40Ω Operating Temperature:-40℃~+125℃ Operating Temperature:-40℃~+125℃; LCSC Part Name: 8MHz ±0.07% 内置负载电容:33pF; Supplier Part: C341525; Manufacturer: muRata(村田); Supplier Footprint: SMD3213-3P; JLCPCB Part Class: Extended Part; Datasheet: https://item.szlcsc.com/datasheet/CSTNE8M00GH5C000R0/318917.html; Supplier: LCSC; Built - in Load Capacitance: 33pF; Resonant Impedance: 40Ω; Operating Temperature: -40℃~+125℃

## Nets
+3.3V: C6.1 C7.2 C8.1 C9.1 C10.1 C20.2 C21.1 C22.1 H9.1 H17.6 H20.6 H21.6 H27.1 H27.2 H27.3 H28.1 H29.1 LED1.3(V1) LED1.8(V2) R22.2 R23.1 R24.1 R25.2 R27.2 R28.1 R30.2 R33.1 R34.1 R40.1 R42.2 R43.2 R44.2 R45.2 R51.2 R57.2 R58.2 R59.2 R65.3 R66.3 R67.3 U1.1(VLCD) U1.13(VDDA) U1.19(VDD) U1.32(VDD) U1.48(VDD_USB) U1.64(VDD) U2.10(MR#) U2.16(VCC) U8.3(VDD) U9.2(VOUT) U14.8(VCC)
+5V: C4.2 C5.1 H2.6 H11.1 H22.1 H23.1 H27.4 H27.5 H27.6 R52.2 U4.A4B9(VBUS) U4.B4A9(VBUS) U9.3(VIN) U13.B3(Vbus)
GND: C1.1 C2.1 C3.1 C4.1 C5.2 C6.2 C7.1 C8.2 C9.2 C10.2 C14.1 C15.1 C16.1 C17.1 C20.1 C23.2 C24.2 C25.2 C26.2 H2.5 H7.1 H7.2 H7.3 H7.4 H8.2 H9.4 H11.4 H12.1 H15.1 H17.1 H20.1 H21.1 H22.4 H23.4 H28.4 H29.4 LED9.1(K) LED10.1(K) LED12.1(K) LED13.2 LED14.2 LED15.2(C) LED16.2(K) R19.1 R20.1 R21.1 R29.1 R38.2 R65.1 R66.1 R67.1 SW1.1 SW2.1 SW3.1 SW4.1 SW11.1 SW11.2 U1.12(VSSA) U1.18(VSS) U1.31(VSS) U1.47(VSS) U1.63(VSS) U2.8(GND) U4.A1B12(GND) U4.B1A12(GND) U8.1(GND) U9.1(GND) U13.D2(GND) U14.5(VO1)
BOOT0: R30.1 R60.1 U1.60(BOOT0)
D+: R62.2 U1.45(PA12) U13.C3(D+out)
D+IN: R62.1 U4.A6(DP1) U13.C1(D+in)
D-: R61.2 U1.44(PA11) U13.D3(D-out)
D-IN: R61.1 U4.A7(DN1) U13.D1(D-in)
NRST: H2.4 U1.7(NRST)
PA0: C1.2 R19.2 R65.2 U1.14(PA0)
PA1: C2.2 R20.2 R66.2 U1.15(PA1)
PA2: C3.2 R21.2 R67.2 U1.16(PA2)
PA3: R27.1 U1.17(PA3) U8.2(DQ)
PA4: R28.2 R29.2 U1.20(PA4)
PA5: H12.2 U1.21(PA5)
PA6: H13.1 U1.22(PA6)
PA7: H13.2 U1.23(PA7)
PA8: R9.2 U1.41(PA8)
PA9: H9.3 H28.3 H29.3 LED8.2(-) U1.42(PA9)
PA10: H9.2 H28.2 H29.2 LED17.2(-) U1.43(PA10)
PA13: H2.3 U1.46(PA13)
PA14: H2.2 U1.49(PA14)
PA15: H17.2 H20.2 H21.2 U1.50(PA15)
PB0: C14.2 R34.2 SW11.3 U1.26(PB0)
PB1: R22.1 SW1.4 U1.27(PB1)
PB2: R23.2 SW2.4 U1.28(PB2)
PB3: H17.3 H20.3 H21.3 U1.55(PB3)
PB4: H17.4 H20.4 H21.4 U1.56(PB4)
PB5: H17.5 H20.5 H21.5 U1.57(PB5)
PB7: H15.2 U1.59(PB7)
PB8: H11.3 H22.3 H23.3 U1.61(PB8)
PB9: H11.2 H22.2 H23.2 U1.62(PB9)
PB10: R24.2 SW3.4 U1.29(PB10)
PB11: R25.1 SW4.4 U1.30(PB11)
PB12: U1.36(PB15) U2.13(OE#)
PB13: U1.35(PB14) U2.11(SHCP)
PB14: U1.34(PB13) U2.12(STCP)
PB15: U1.33(PB12) U2.14(DS)
PC0: H3.4 U1.8(PC0)
PC1: H3.3 U1.9(PC1)
PC2: H3.2 U1.10(PC2)
PC3: H3.1 U1.11(PC3)
PC5: C15.2 R33.2 SW11.4 U1.25(PC5)
PC6: R13.2 U1.37(PC6)
PC7: R12.2 U1.38(PC7)
PC8: R11.2 U1.39(PC8)
PC9: R10.2 U1.40(PC9)
PC10: R45.1 U1.51(PC10) U14.4(DI)
PC11: R44.1 U1.52(PC11) U14.3(DE)
PC12: R43.1 U1.53(PC12) U14.2(RE#)
PC15: H3.5 U1.4(PC15-OSC32_OUT)
PD2: R42.1 U1.54(PD2) U14.1(R0)
RS_LED: LED11.1(K) P1.1 R39.1 R40.2 U14.6(A)
SEGA: LED1.7(A) R8.2
SEGB: LED1.6(B) R1.1
SEGC: LED1.4(C) R2.1
SEGD: LED1.2(D) R3.1
SEGDP: LED1.5(DP) R7.1
SEGE: LED1.1(E) R4.1
SEGF: LED1.9(F) R5.1
SEGG: LED1.10(G) R6.1
$1N873: R1.2 U2.1(Q1)
$1N1103: R2.2 U2.2(Q2)
$1N1142: R3.2 U2.3(Q3)
$1N1181: R4.2 U2.4(Q4)
$1N1220: R5.2 U2.5(Q5)
$1N1259: R6.2 U2.6(Q6)
$1N1298: R7.2 U2.7(Q7)
$1N1337: R8.1 U2.15(Q0)
$1N1938: LED16.1(A) R9.1
$1N1977: LED12.2(A) R10.1
$1N2016: LED15.1(A) R11.1
$1N2055: LED13.1 R12.1
$1N2094: LED14.1 R13.1
$1N15849: C17.2 U1.6(PH1-OSC_OUT) X1.1(OSC1)
$1N15856: C16.2 U1.5(PH0-OSC_IN) X1.3(OSC2)
$1N47761: P1.2 R38.1 R39.2 U14.7(B)
$1N55994: LED9.2(A) R51.1
$1N56128: LED10.2(A) R52.1
$1N56458: LED11.2(A) R57.1
$1N56501: C21.2 C22.2
$1N56861: LED8.1(+) R59.1
$1N57464: H8.1 R60.2
$1N58918: LED17.1(+) R58.1
$1N63238: C23.1 SW1.3
$1N63239: C24.1 SW2.3
$1N63240: C25.1 SW3.3
$1N63241: C26.1 SW4.3

Not connected (* = marked no-connect by the designer): H2 1*; R65 4* 5*; R66 4* 5*; R67 4* 5*; SW1 2*; SW2 2*; SW3 2*; SW4 2*; U1 2(PC13)* 3(PC14-OSC32_IN)* 24(PC4)* 58(PB6)*; U2 9(Q7S)*; U4 1* 2* 3* 4* A5(CC1)* A8(SBU1)* B5(CC2)* B6(DP2)* B7(DN2)* B8(SBU2)*; U13 A2(Dz)* A3(ID)* B1(Pd1)* B2(Pup)* C2(Pd2)*; X1 2(GND)*

## Notes on the sheet
- 7 SEGMENT LED
- 5 LED
- 4 BUTTON
- 2 SWITCH
- POTENSIOMETER
- SPI HEADER
- TEMPERATURE
  SENSOR
- USB
- LDR
- MOSI
- MISO
- SCK
- CS
- MISO
- MOSI
- SCK
- CS
- PROGRAMMING
         HEADER
- POWER
- I2C
- 5 GPIO
- GPIO_OUT
- RESET
- SWDIO
- SWCLK
- MISO
- MOSI
- I2C_SDA
- I2C_SCL
- I2C_SDA
- I2C_SCL
- I2C_SDA
- I2C_SCL
- SCK
- CS
- DAC OUTPUT
- PWM
- COMP
- UART
- BOOT0
- OUT1
- RX1
- TX1
- RX1
- TX1
- RX1
- TX1
- RS485
- 3.3V REGULATOR
- GND
